# EAGLE design RGB Encoder Switcher QSB v1p2 (EAGLE 9.6.2)
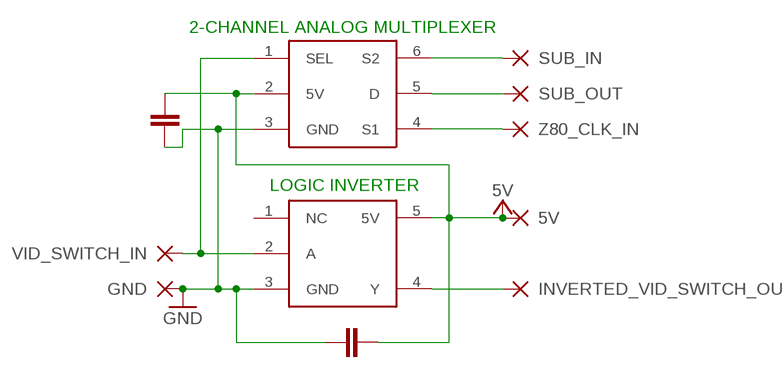
[diagram p0: schematic, sheet 1]

## Parts
5V  PADSCIRCLE-1,5X1,5  [CIRCLE-1,5X1,5]
C1  0.1uF  CAPACITORSC0603  [C0603]
C2  0.1uF  CAPACITORSC0603  [C0603]
GND  PADSCIRCLE-1,5X1,5  [CIRCLE-1,5X1,5]
INVERTED_VID_SWITCH_OUT  PADSCIRCLE-1,5X1,5  [CIRCLE-1,5X1,5]
INVERTER  74AHCT1G04DBVRE4  [SOT95P280X110-5N]
MULTIPLEXER  TMUX1219DBVR  [SOT95P280X110-6N]
SUB_IN  PADSCIRCLE-1,5X1,5  [CIRCLE-1,5X1,5]
SUB_OUT  PADSCIRCLE-1,5X1,5  [CIRCLE-1,5X1,5]
VID_SWITCH_IN  PADSCIRCLE-1,5X1,5  [CIRCLE-1,5X1,5]
Z80_CLK_IN  PADSCIRCLE-1,5X1,5  [CIRCLE-1,5X1,5]

## Nets
+5V: 5V.1(P) C1.1 C2.2 INVERTER.5(5V) MULTIPLEXER.2(5V) ; supply symbol labelled 5V
GND: C1.2 C2.1 GND.1(P) INVERTER.3(GND) MULTIPLEXER.3(GND)
INVERTED_VID_SWITCH_OUT: INVERTED_VID_SWITCH_OUT.1(P) INVERTER.4(Y)
SUB_IN: MULTIPLEXER.6(S2) SUB_IN.1(P)
SUB_OUT: MULTIPLEXER.5(D) SUB_OUT.1(P)
VID_SWITCH_IN: INVERTER.2(A) MULTIPLEXER.1(SEL) VID_SWITCH_IN.1(P)
Z80_CLK_IN: MULTIPLEXER.4(S1) Z80_CLK_IN.1(P)
Unconnected: INVERTER.1(NC)

## Notes on the sheet
- 2-CHANNEL ANALOG MULTIPLEXER
- LOGIC INVERTER

## Library data of the parts
5V GND INVERTED_VID_SWITCH_OUT SUB_IN SUB_OUT VID_SWITCH_IN Z80_CLK_IN = Consoles Unleashed Eagle Parts Library:PADS: PADS connect wires to PCB
C1 C2 = Consoles Unleashed Eagle Parts Library:CAPACITORS: CAPACITOR, European symbol; SPICEPREFIX: C
INVERTER = Consoles Unleashed Eagle Parts Library:74AHCT1G04DBVRE4
MULTIPLEXER = Consoles Unleashed Eagle Parts Library:TMUX1219DBVR

## Board
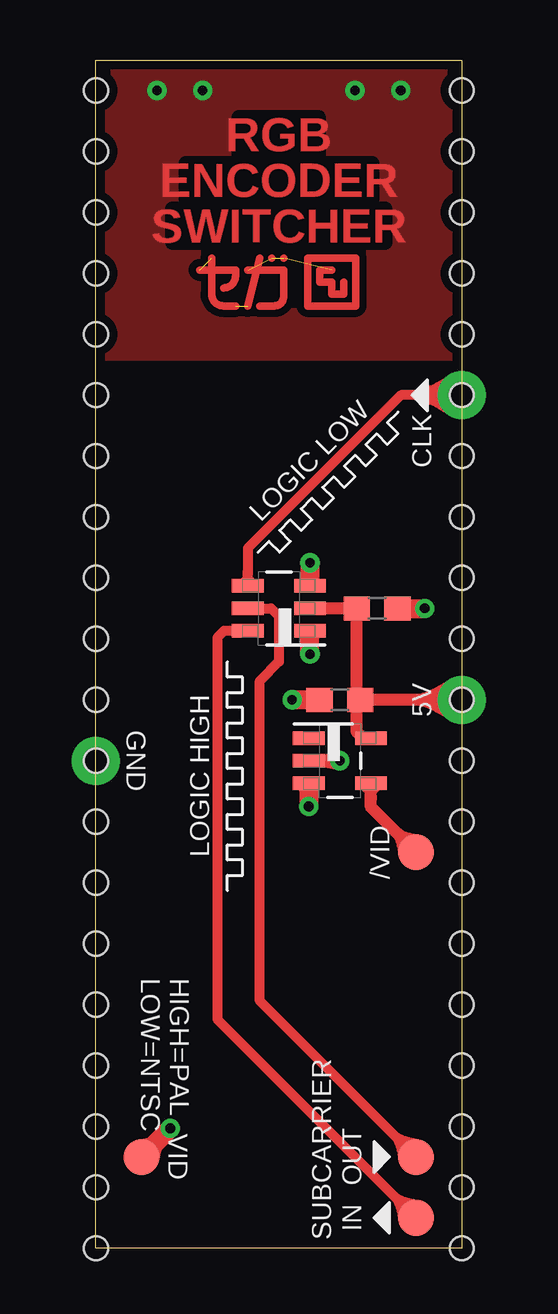
[diagram p1: board, top side]
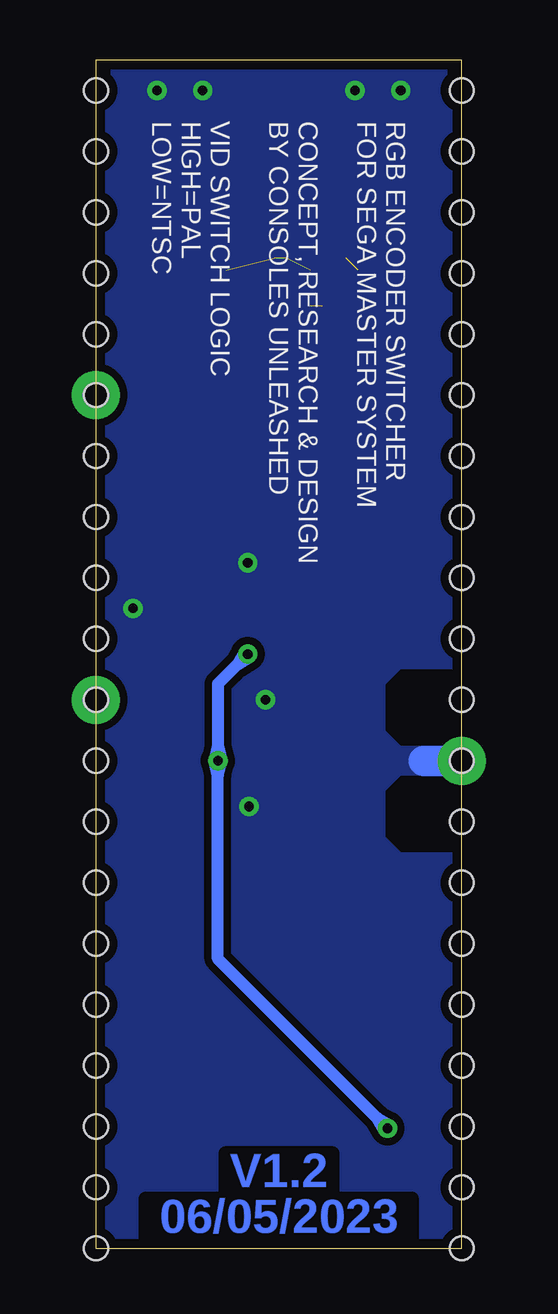
[diagram p2: board, bottom side, seen from below]

Size 15.24 x 49.53 mm. Coordinates in mm from the lower left corner, seen from the top.
Outline: 15.24,0 0,0 0,49.53 15.24,49.53 15.24,0
Copper layers (1*16): Top 0.035559375mm / dielectric 1.6mm / Bottom 0.035559375mm
Design rules "oshpark-2layer *": minimum track width 6mil, minimum drill 10mil, track to track 6mil, track to pad 6mil, pad to pad 6mil, via to via 6mil, smd to smd 6mil, copper to edge 15mil, drill to drill 6mil, minimum pad ring 5mil, minimum via ring 5mil, stop-mask expansion 2.5mil, vias tented up to drill 1mm, thermal gap 12mil
Holes 1 mm at 0,0 0,2.54 0,5.08 0,7.62 0,10.16 0,12.7 0,15.24 0,17.78 0,20.32 0,22.86 0,25.4 0,27.94 0,30.48 0,33.02 0,35.56 0,38.1 0,40.64 0,43.18 0,45.72 0,48.26 15.24,0 15.24,2.54 15.24,5.08 15.24,7.62 15.24,10.16 15.24,12.7 15.24,15.24 15.24,17.78 15.24,20.32 15.24,22.86 15.24,25.4 15.24,27.94 15.24,30.48 15.24,33.02 15.24,35.56 15.24,38.1 15.24,40.64 15.24,43.18 15.24,45.72 15.24,48.26

### Footprints (pad centres in the part's own frame; a part is rotated, then mirrored left to right if it is on the bottom)
CIRCLE-1,5X1,5 = smd 1.5 x 1.5: 1 0,0
C0603 = smd 1.1 x 1: 1 -0.85,0; 2 0.85,0
SOT95P280X110-5N = smd 1.321 x 0.559: 1 -1.295,0.94; 2 -1.295,0; 3 -1.295,-0.94; 4 1.295,-0.94; 5 1.295,0.94
SOT95P280X110-6N = smd 1.321 x 0.559: 1 -1.295,0.94; 2 -1.295,0; 3 -1.295,-0.94; 4 1.295,-0.94; 5 1.295,0; 6 1.295,0.94

### Placement (x,y rotation side)
5V  15.24,22.86 0 top
C1  11.71,26.67 0 top
C2  10.16,22.86 0 top
GND  0,20.32 0 top
INVERTED_VID_SWITCH_OUT  13.34,16.51 0 top
INVERTER  10.16,20.32 0 top
MULTIPLEXER  7.62,26.67 180 top
SUB_IN  13.34,1.27 0 top
SUB_OUT  13.34,3.81 0 top
VID_SWITCH_IN  1.91,3.81 0 top
Z80_CLK_IN  15.24,35.56 0 top

### Tracks (layer width: path | path; a pad name or v marks a point on that pad's centre or on a via)
+5V  (via drill 1 pad 2)
  Top 0.406: 13.34,22.86 arc20 14.76,23.5 14.76,22.23 arc20 13.34,22.86
  Top 0.508: C2.2 10.85,22.7 10.85,21.55 11.14,21.26 INVERTER.5 | MULTIPLEXER.2 C1.1 10.85,26.66 10.85,23.02 C2.2 | 5V.1 13.46,22.86 13.34,22.86 C2.2
  other vias: 15.24,22.86
AVOID1
  cutout Bottom: -1.27,24.13 2.54,24.13 3.17,23.5 3.17,21.59 2.54,20.95 1.27,20.95 1.27,19.69 2.54,19.69 3.17,19.05 3.17,17.14 2.54,16.51 -1.27,16.51
AVOID2
  cutout Top: 5.08,41.91 5.08,39.37 7.62,39.37 7.62,41.91
GND  (via drill 0.4 pad 0.8, 1 pad 2)
  Top 0.508: INVERTER.3 8.87,19.12 | MULTIPLEXER.3 8.91,27.87
  Top 0.8: C1.2 v13.7,26.67 | 8.87,19.12 v8.87,18.41 | C2.1 v8.18,22.86 | v8.91,28.57 8.91,27.87
  Bottom 1.27: GND.1 1.59,20.32
  other vias: 0,20.32 10.79,48.26 12.7,48.26 2.54,48.26 4.45,48.26
  pour Bottom (isolate 0.305): 0,49.53 0,0 15.24,0 15.24,49.53
  pour Top (isolate 0.305): 0,37.15 15.24,37.15 15.24,49.53 0,49.53
INVERTED_VID_SWITCH_OUT
  Top 0.152: 10.95,19.31 11.46,18.81 11.72,19.08 11.93,19.29
  Top 0.406: 12.54,17.3 arc-20 12.8,16.45 13.39,17.04 arc-20 12.54,17.3
  Top 0.508: INVERTED_VID_SWITCH_OUT.1 12.54,17.3 11.46,18.39 11.46,18.73 11.46,18.81 INVERTER.4
LOGO  (5 unrouted)
  Top 0.305: 7.32,41.28 | 7.82,41.28 | 6.69,40.78 6.82,41.28 6.69,40.78 | 6.69,40.78 6.82,40.78 | 6.82,40.78 7.82,40.78 7.82,39.66 arc-90 7.44,39.28 6.82,39.28 | 6.69,40.78 6.32,39.28 | 6.32,40.78 6.69,40.78 | 6.69,40.78 6.82,40.78 | 4.82,41.28 4.82,39.78 arc90 5.32,39.28 5.82,39.28 | 4.32,40.78 5.82,40.78 5.82,40.53 arc-90 5.32,40.03 | 9.81,40.78 9.31,40.78 9.31,40.28 9.81,40.28 9.81,39.78 10.31,39.78 10.31,40.28 | 8.81,41.28 8.81,39.28 10.81,39.28 10.81,41.28 8.81,41.28
SUB_IN
  Top 0.406: MULTIPLEXER.6 5.33,25.73 5.05,25.45 5.05,9.55 12.54,2.06 | SUB_IN.1 12.54,2.06 | 12.54,2.06 arc-20 12.8,1.21 13.39,1.8 arc-20 12.54,2.06
SUB_OUT
  Top 0.406: SUB_OUT.1 12.54,4.6 | 12.54,4.6 6.83,10.32 6.83,23.65 7.62,24.45 7.62,26.35 7.3,26.67 MULTIPLEXER.5 | 12.54,4.6 arc-20 12.8,3.75 13.39,4.34 arc-20 12.54,4.6
VID_SWITCH_IN  (via drill 0.4 pad 0.8)
  Top 0.406: v3.1,5 3.19,4.83 2.68,4.57 2.92,5.08 v3.1,5 | v3.1,5 3.18,4.82 2.66,4.58 2.92,5.09 v3.1,5 | 2.7,4.6 arc20 2.44,3.75 1.85,4.34 arc20 2.7,4.6
  Top 0.508: MULTIPLEXER.1 8.91,25.51
  Top 0.56: v10.16,20.32 INVERTER.2 | v10.16,20.32 10.14,20.2 9.56,20.32 10.14,20.44 v10.16,20.32
  Top 0.8: VID_SWITCH_IN.1 2.7,4.6 v3.1,5 | v8.91,24.77 8.91,25.51
  Bottom 0.508: v10.16,20.32 10.16,12.06 v3.1,5 | v8.91,24.77 10.16,23.52 v10.16,20.32 | v3.1,5 3.02,5.13 3.52,5.42 3.22,4.93 v3.1,5 | v10.16,20.32 10.3,20.28 10.16,19.72 10.02,20.28 v10.16,20.32 | v10.16,20.32 10.02,20.36 10.16,20.92 10.3,20.36 v10.16,20.32 | v8.91,24.77 9.04,24.84 9.34,24.34 8.84,24.64 v8.91,24.77
Z80_CLK_IN  (via drill 1 pad 2)
  Top 0.152: 6.01,27.78 6.33,28.1 6.64,27.78 6.33,27.78 MULTIPLEXER.4
  Top 0.406: MULTIPLEXER.4 6.33,28.1 6.33,28.18 6.33,28.26 6.33,29.18 12.7,35.56 13.34,35.56 | Z80_CLK_IN.1 13.34,35.56 | 13.34,35.56 arc20 14.76,36.2 14.76,34.92 arc20 13.34,35.56
  other vias: 15.24,35.56

### Text on the board
Top: RGB | ENCODER | SWITCHER
Bottom: V1.2 | 06/05/2023
tNames: CLK | LOGIC LOW | 5V | GND | LOGIC HIGH | /VID | HIGH=PAL / LOW=NTSC | VID | SUBCARRIER | OUT | IN
bNames: RGB ENCODER SWITCHER / FOR SEGA MASTER SYSTEM / / CONCEPT, RESEARCH & DESIGN / BY CONSOLES UNLEASHED / / VID SWITCH LOGIC / HIGH=PAL / LOW=NTSC